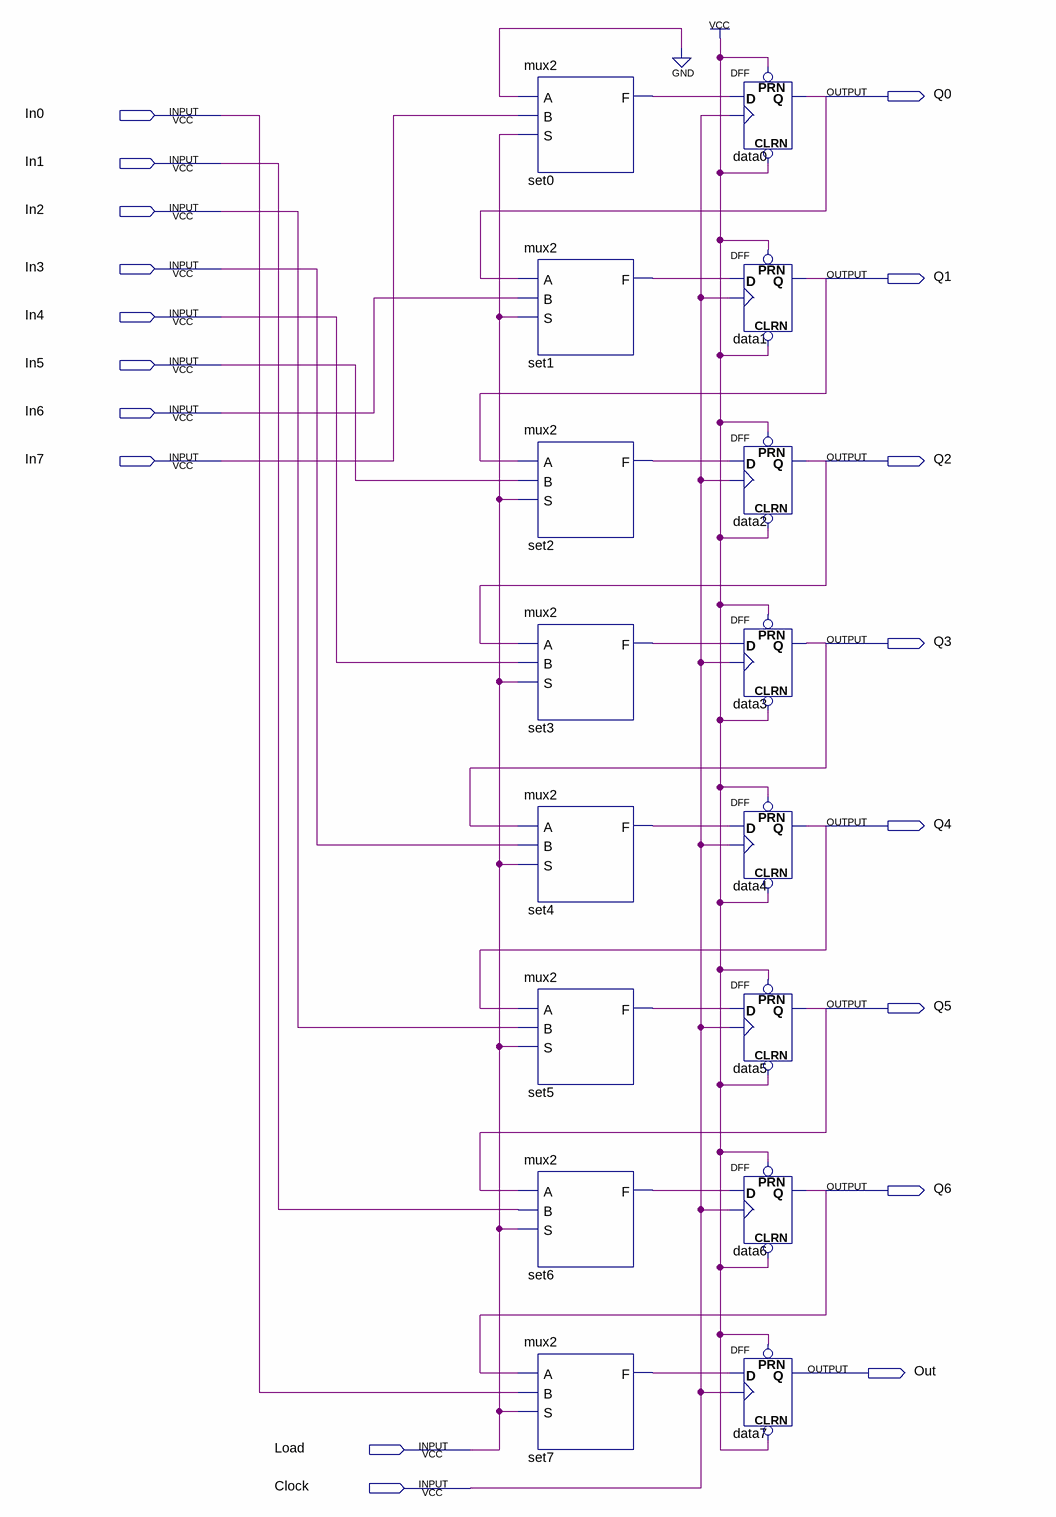
[diagram p0: schematic sheet]
// Quartus schematic 8bit_shift_register.bdf as structural Verilog: 16 symbols, 18 pins
module \8bit_shift_register  (
  input  In0,
  input  In1,
  input  In2,
  input  In3,
  input  In4,
  input  In5,
  input  In6,
  input  In7,
  input  Load,
  input  Clock,
  output Q0,
  output Q1,
  output Q2,
  output Q3,
  output Q4,
  output Q5,
  output Q6,
  output Out
);

  wire set0_f, set1_f, set2_f, set3_f, set4_f, set5_f, set6_f, set7_f;

  mux2 set0 (.A(1'b0), .B(In7), .S(Load), .F(set0_f));
  mux2 set1 (.A(Q0), .B(In6), .S(Load), .F(set1_f));
  mux2 set2 (.A(Q1), .B(In5), .S(Load), .F(set2_f));
  mux2 set3 (.A(Q2), .B(In4), .S(Load), .F(set3_f));
  mux2 set4 (.A(Q3), .B(In3), .S(Load), .F(set4_f));
  mux2 set5 (.A(Q4), .B(In2), .S(Load), .F(set5_f));
  mux2 set6 (.A(Q5), .B(In1), .S(Load), .F(set6_f));
  mux2 set7 (.A(Q6), .B(In0), .S(Load), .F(set7_f));
  DFF data0 (.CLRN(1'b1), .CLK(Clock), .D(set0_f), .PRN(1'b1), .Q(Q0));
  DFF data1 (.CLRN(1'b1), .CLK(Clock), .D(set1_f), .PRN(1'b1), .Q(Q1));
  DFF data2 (.CLRN(1'b1), .CLK(Clock), .D(set2_f), .PRN(1'b1), .Q(Q2));
  DFF data3 (.CLRN(1'b1), .CLK(Clock), .D(set3_f), .PRN(1'b1), .Q(Q3));
  DFF data4 (.CLRN(1'b1), .CLK(Clock), .D(set4_f), .PRN(1'b1), .Q(Q4));
  DFF data5 (.CLRN(1'b1), .CLK(Clock), .D(set5_f), .PRN(1'b1), .Q(Q5));
  DFF data6 (.CLRN(1'b1), .CLK(Clock), .D(set6_f), .PRN(1'b1), .Q(Q6));
  DFF data7 (.CLRN(1'b1), .CLK(Clock), .D(set7_f), .PRN(1'b1), .Q(Out));
endmodule
